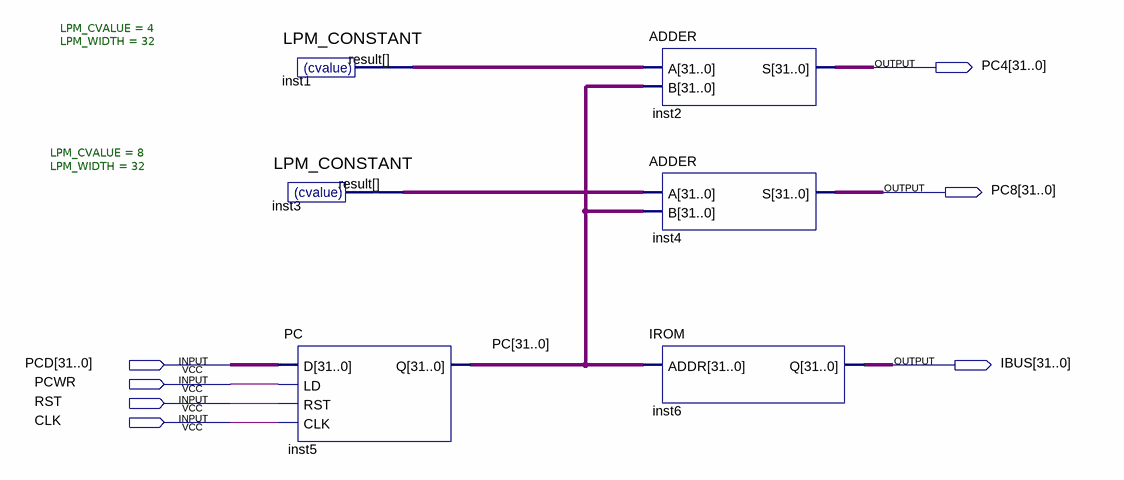
[diagram p0: schematic sheet]
// Quartus schematic fetch.bdf as structural Verilog: 6 symbols, 7 pins
module fetch (
  input  [31:0] PCD,
  input  PCWR,
  input  RST,
  input  CLK,
  output [31:0] PC4,
  output [31:0] PC8,
  output [31:0] IBUS
);

  wire [31:0] inst1_result, inst3_result, PC;

  LPM_CONSTANT #(.LPM_CVALUE(4), .LPM_WIDTH(32)) inst1 (.result(inst1_result));
  LPM_CONSTANT #(.LPM_CVALUE(8), .LPM_WIDTH(32)) inst3 (.result(inst3_result));
  PC inst5 (.D(PCD), .LD(PCWR), .RST(RST), .CLK(CLK), .Q(PC));
  ADDER inst2 (.A(inst1_result), .B(PC), .S(PC4));
  ADDER inst4 (.A(inst3_result), .B(PC), .S(PC8));
  IROM inst6 (.ADDR(PC), .Q(IBUS));
endmodule
